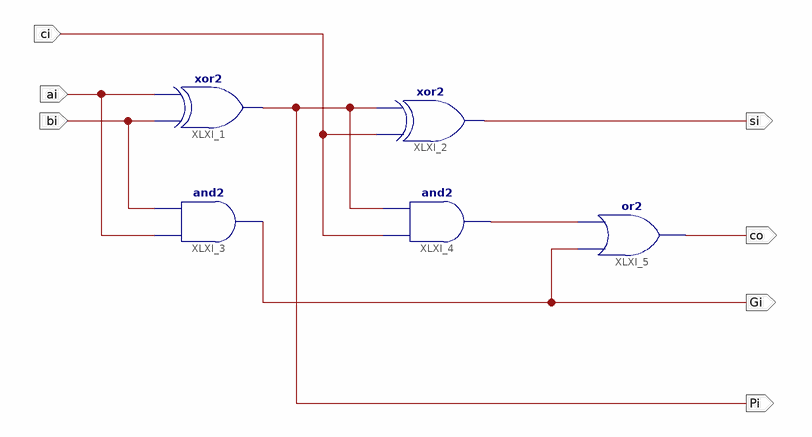
[diagram p0: schematic sheet 1]
// Xilinx ISE schematic add.sch (kintex7) as structural Verilog: 5 symbols, 7 ports
module add (
  input  ai,
  input  bi,
  input  ci,
  output si,
  output co,
  output Gi,
  output Pi
);

  wire XLXN_8;

  xor XLXI_1 (Pi, bi, ai);
  xor XLXI_2 (si, ci, Pi);
  and XLXI_3 (Gi, ai, bi);
  and XLXI_4 (XLXN_8, ci, Pi);
  or XLXI_5 (co, Gi, XLXN_8);
endmodule
